# Altium project DE-160516.PrjPcb
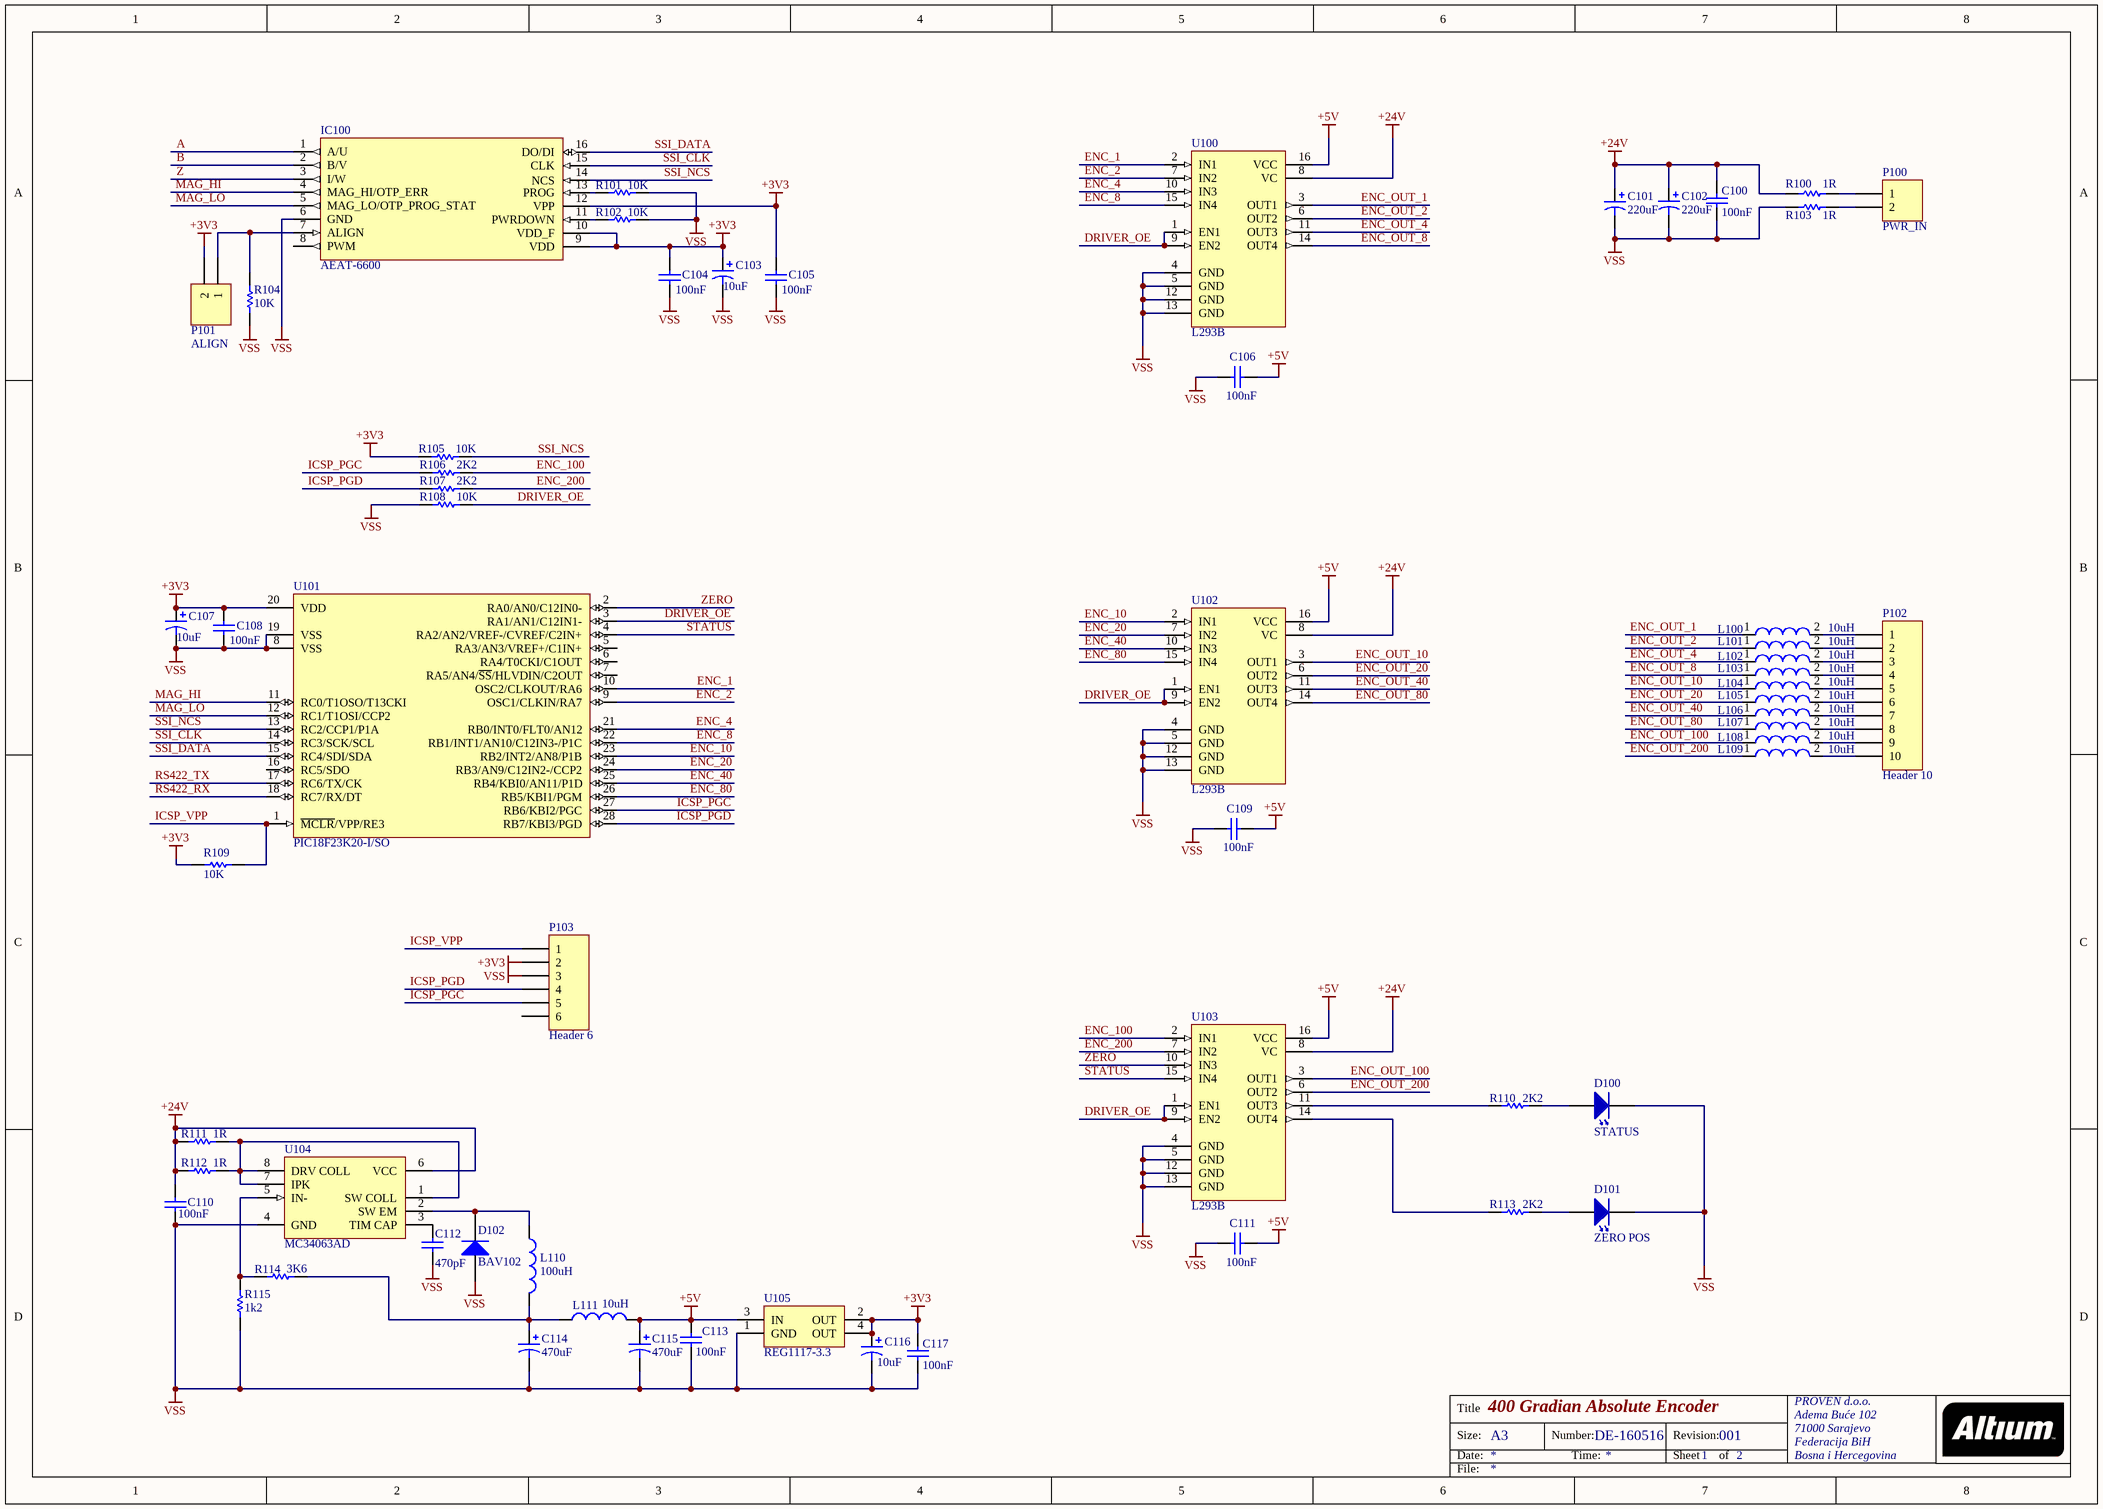
[diagram p0: DE-160516.SchDoc]
1 sheet, 60 parts. Net scope: global (net labels, ports and power ports of the same name join across sheets).
Board file: DE-160516.PcbDoc

## Sheet DE-160516.SchDoc: 400 Gradian Absolute Encoder
size A3; Author: eldar6776@hotmail.com; DrawnBy: Eldar Dedić; Organization: PROVEN d.o.o.; Address1: Adema Buće 102; Address2: 71000 Sarajevo; Address3: Federacija BiH; Address4: Bosna i Hercegovina; DocumentNumber: DE-160516; Revision: 001; SheetNumber: 1; SheetTotal: 2; ProjectName: ABSOLUT_ENCODER

### Parts
C100  value 100nF  [0805]
C101  220uF  [E]
C102  220uF  [E]
C103  10uF  [C]
C104  value 100nF  [0805]
C105  value 100nF  [0805]
C106  value 100nF  [0805]
C107  10uF  [C]
C108  value 100nF  [0805]
C109  value 100nF  [0805]
C110  value 100nF  [1206]
C111  value 100nF  [0805]
C112  value 470pF  [0805]
C113  value 100nF  [0805]
C114  470uF  [CAPPR2.5-6.3X11]
C115  470uF  [CAPPR2.5-6.3X11]
C116  10uF  [49BC-C]
C117  value 100nF  [0805]
D100  STATUS  [LED 3mm]
D101  ZERO POS  [LED 3mm]
D102  BAV102  [SOD80C]
IC100  AEAT-6600  [TSSOP16]
L100  10uH  [SMD-0603]
L101  10uH  [SMD-0603]
L102  10uH  [SMD-0603]
L103  10uH  [SMD-0603]
L104  10uH  [SMD-0603]
L105  10uH  [SMD-0603]
L106  10uH  [SMD-0603]
L107  10uH  [SMD-0603]
L108  10uH  [SMD-0603]
L109  10uH  [SMD-0603]
L110  value 100uH  [RB5-10.5]
L111  value 10uH  [RB5-10.5]
P100  PWR_IN  [HDR1X2]
P101  ALIGN  [HDR1X2]
P102  Header 10  [HDR1X10]
P103  Header 6  [HDR1X6]
R100  1R  [RD6.35x2.3]
R101  10K  [ERA-0603]
R102  10K  [ERA-0603]
R103  1R  [RD6.35x2.3]
R104  10K  [ERA-0603]
R105  10K  [ERA-0603]
R106  2K2  [ERA-0603]
R107  2K2  [ERA-0603]
R108  10K  [ERA-0603]
R109  10K  [ERA-0603]
R110  2K2  [ERA-0603]
R111  1R  [ERA-0805]
R112  1R  [ERA-0805]
R113  2K2  [ERA-0603]
R114  3K6  [ERA-0805]
R115  1k2  [ERA-0805]
U100  L293B  [DIP16]
U101  PIC18F23K20-I/SO  [SOIC-SO28_N]
U102  L293B  [DIP16]
U103  L293B  [DIP16]
U104  MC34063AD  [751-05_N]
U105  REG1117-3.3  [ZZ311]

### Nets
+3V3: C103.1 C104.2 C105.2 C107.1 C108.2 C116.1 C117.2 IC100.9(VDD) IC100.10(VDD_F) IC100.12(VPP) P101.2 P103.2 R105.2 R109.2 U101.20(VDD) U105.2(OUT) U105.4(OUT)
+5V: C106.1 C109.1 C111.1 C113.2 C115.1 L111.2 U100.16(VCC) U102.16(VCC) U103.16(VCC) U105.3(IN)
+24V: C100.2 C101.1 C102.1 C110.2 R100.1 R111.1 R112.1 U100.8(VC) U102.8(VC) U103.8(VC) U104.6(VCC)
VSS: C100.1 C101.2 C102.2 C103.2 C104.1 C105.1 C106.2 C107.2 C108.1 C109.2 C110.1 C111.2 C112.1 C113.1 C114.2 C115.2 C116.2 C117.1 D100.1 D101.1 D102.1(A) IC100.6(GND) P103.3 R101.1 R102.1 R103.1 R104.1 R108.2 R115.1 U100.4(GND) U100.5(GND) U100.12(GND) U100.13(GND) U101.8(VSS) U101.19(VSS) U102.4(GND) U102.5(GND) U102.12(GND) U102.13(GND) U103.4(GND) U103.5(GND) U103.12(GND) U103.13(GND) U104.4(GND) U105.1(GND)
A: IC100.1(A/U)
B: IC100.2(B/V)
DRIVER_OE: R108.1 U100.1(EN1) U100.9(EN2) U101.3(RA1/AN1/C12IN1-) U102.1(EN1) U102.9(EN2) U103.1(EN1) U103.9(EN2)
ENC_1: U100.2(IN1) U101.10(OSC2/CLKOUT/RA6)
ENC_2: U100.7(IN2) U101.9(OSC1/CLKIN/RA7)
ENC_4: U100.10(IN3) U101.21(RB0/INT0/FLT0/AN12)
ENC_8: U100.15(IN4) U101.22(RB1/INT1/AN10/C12IN3-/P1C)
ENC_10: U101.23(RB2/INT2/AN8/P1B) U102.2(IN1)
ENC_20: U101.24(RB3/AN9/C12IN2-/CCP2) U102.7(IN2)
ENC_40: U101.25(RB4/KBI0/AN11/P1D) U102.10(IN3)
ENC_80: U101.26(RB5/KBI1/PGM) U102.15(IN4)
ENC_100: R106.1 U103.2(IN1)
ENC_200: R107.1 U103.7(IN2)
ENC_OUT_1: L100.1 U100.3(OUT1)
ENC_OUT_2: L101.1 U100.6(OUT2)
ENC_OUT_4: L102.1 U100.11(OUT3)
ENC_OUT_8: L103.1 U100.14(OUT4)
ENC_OUT_10: L104.1 U102.3(OUT1)
ENC_OUT_20: L105.1 U102.6(OUT2)
ENC_OUT_40: L106.1 U102.11(OUT3)
ENC_OUT_80: L107.1 U102.14(OUT4)
ENC_OUT_100: L108.1 U103.3(OUT1)
ENC_OUT_200: L109.1 U103.6(OUT2)
ICSP_PGC: P103.5 R106.2 U101.27(RB6/KBI2/PGC)
ICSP_PGD: P103.4 R107.2 U101.28(RB7/KBI3/PGD)
ICSP_VPP: P103.1 R109.1 U101.1(~{MCLR}/VPP/RE3)
MAG_HI: IC100.4(MAG_HI/OTP_ERR) U101.11(RC0/T1OSO/T13CKI)
MAG_LO: IC100.5(MAG_LO/OTP_PROG_STAT) U101.12(RC1/T1OSI/CCP2)
RS422_RX: U101.18(RC7/RX/DT)
RS422_TX: U101.17(RC6/TX/CK)
SSI_CLK: IC100.15(CLK) U101.14(RC3/SCK/SCL)
SSI_DATA: IC100.16(DO/DI) U101.15(RC4/SDI/SDA)
SSI_NCS: IC100.14(NCS) R105.1 U101.13(RC2/CCP1/P1A)
STATUS: U101.4(RA2/AN2/VREF-/CVREF/C2IN+) U103.15(IN4)
Z: IC100.3(I/W)
ZERO: U101.2(RA0/AN0/C12IN0-) U103.10(IN3)
NetC112_2: C112.2 U104.3(TIM_CAP)
NetC114_1: C114.1 L110.2 L111.1 R114.2
NetD100_2: D100.2 R110.2
NetD101_2: D101.2 R113.2
NetD102_2: D102.2(K) L110.1 U104.2(SW_EM)
NetIC100_7: IC100.7(ALIGN) P101.1 R104.2
NetIC100_11: IC100.11(PWRDOWN) R102.2
NetIC100_13: IC100.13(PROG) R101.2
NetL100_2: L100.2 P102.1
NetL101_2: L101.2 P102.2
NetL102_2: L102.2 P102.3
NetL103_2: L103.2 P102.4
NetL104_2: L104.2 P102.5
NetL105_2: L105.2 P102.6
NetL106_2: L106.2 P102.7
NetL107_2: L107.2 P102.8
NetL108_2: L108.2 P102.9
NetL109_2: L109.2 P102.10
NetP100_1: P100.1 R100.2
NetP100_2: P100.2 R103.2
NetR110_1: R110.1 U103.11(OUT3)
NetR111_2: R111.2 R112.2 U104.1(SW_COLL) U104.7(IPK) U104.8(DRV_COLL)
NetR113_1: R113.1 U103.14(OUT4)
NetR114_1: R114.1 R115.2 U104.5(IN-)

Not connected (* = marked no-connect by the designer): IC100 8(PWM); P103 6; U101 5(RA3/AN3/VREF+/C1IN+) 6(RA4/T0CKI/C1OUT) 7(RA5/AN4/~{SS}/HLVDIN/C2OUT) 16(RC5/SDO)

### Notes on the sheet
- Title
- Size:
- Date:
- A3
- Number:
- Time:
- Revision:
- Sheet
- of
- File:

### Library data of the parts
C100 C104-C106 C108 C109 C111-C113 C117 = C0805: Ceramic Chip Capacitor - Standard; Note: Footprint corresponds to dimensions for bulk cassette packaging. This case size has tightened tolerances.; Published: 17-Jul-2002; LatestRevisionDate: 19-Mar-2004; LatestRevisionNote: Silkscreen size reduced.; DatasheetDocument: Mar-2001; PackageDocument: Mar-2001; PackageReference: 0805; Publisher: Altium Limited; Code_JEITA: 0805; Code_IPC: 2012[0805]; ComponentLink1Description: Manufacturer Link; ComponentLink1URL: http://www.kemet.com/; ComponentLink2Description: Datasheet; ComponentLink2URL: http://www.kemet.com/kemet/web/homepage/kechome.nsf/vapubfilesname/F3102TA.pdf/$file/F3102TA.pdf
C101 C102 = 94SS107X0020EBP: Solid Aluminum Capacitor with Organic Semiconductor Electrolyte: 100uF, 20V, Bulk Pack; Note: Part Numbers shown are for ± 20% capacitance tolerance (X0).; PCB_Layout: Complies with Manufacturer's Recommendation.; DrillSize: Nominal, Rounded to the nearest 0.1mm; Published: 19-Mar-2004; DatasheetDocument: 23-May-2001; PackageReference: E; Publisher: Altium Limited; ComponentLink1Description: Manufacturer Link; ComponentLink1URL: http://www.vishay.com/; ComponentLink2Description: Datasheet; ComponentLink2URL: http://www.vishay.com/docs/90008/94ss.pdf; Value: 100uF
C103 C107 = 94SC106X0016CBP: Solid Aluminum Capacitor with Organic Semiconductor Electrolyte: 10uF, 16V, Bulk Pack; Note: Part Numbers shown are for ± 20% capacitance tolerance (X0).; PCB_Layout: Complies with Manufacturer's Recommendation.; DrillSize: Nominal, Rounded to the nearest 0.1mm; Published: 19-Mar-2004; DatasheetDocument: 23-May-2001; PackageReference: C; Publisher: Altium Limited; ComponentLink1Description: Manufacturer Link; ComponentLink1URL: http://www.vishay.com/; ComponentLink2Description: Datasheet; ComponentLink2URL: http://www.vishay.com/docs/90004/94sc.pdf; Value: 10uF
C110 = C1206: Ceramic Chip Capacitor - Standard; Published: 17-Jul-2002; LatestRevisionDate: 19-Mar-2004; LatestRevisionNote: Silkscreen size reduced.; DatasheetDocument: Mar-2001; PackageDocument: Mar-2001; PackageReference: 1206; Publisher: Altium Limited; Code_JEITA: 1206; Code_IPC: 3216 [1206]; ComponentLink1Description: Manufacturer Link; ComponentLink1URL: http://www.kemet.com/; ComponentLink2Description: Datasheet; ComponentLink2URL: http://www.kemet.com/kemet/web/homepage/kechome.nsf/vapubfilesname/F3102TA.pdf/$file/F3102TA.pdf
C114 C115 = EKA00BA347C00: Aluminum Electrolytic Capacitor, Radial Style with Long Leads: 470uF, 10V; Note: Refer to Manufacturer's Data Sheets for other lead formations; DrillSize: Nominal, Rounded To The Nearest 0.1mm; Published: 19-Mar-2004; DatasheetDocument: 20-Feb-2001; PackageReference: CAPPR2.5-6.3X11; Publisher: Altium Limited; ComponentLink1Description: Manufacturer Link; ComponentLink1URL: http://www.vishay.com/; ComponentLink2Description: Datasheet; ComponentLink2URL: http://www.vishay.com/docs/25014/eka.pdf; Value: 470uF
C116 = 49BC685B010M: Conformal Coated Solid Tantalum Chip Capacitor: 6.8uF, 20% Tolerance, 10 WVDC @ -55°C to +85°C, Surge = 13V; Note: See Data Sheet for full range of components; Published: 19-Mar-2004; DatasheetDocument: 05-Jul-2002; PackageReference: 49BC-C; Publisher: Altium Limited; ComponentLink1Description: Manufacturer Link; ComponentLink1URL: http://www.vishay.com/; Value: 6.8uF
D100 D101 = LED 3mm yellow: LED dioda 3 mm
D102 = BAV102: General-purpose Diode; Published: 17-Sep-2003; LatestRevisionDate: 19-Mar-2004; LatestRevisionNote: Silkscreen size reduced.; DatasheetVersion: 17-Sep-1996; PackageVersion: Jan-2002; PackageReference: SOD80C; Publisher: Altium Limited; PackageDescription: Metal Electrode Face (MELF) Diode; Body 3.5 x 1.6 mm (LxDia); ComponentLink1Description: Manufacturer Link; ComponentLink1URL: http://www.semiconductors.philips.com/; ComponentLink2Description: Datasheet; ComponentLink2URL: http://www.semiconductors.philips.com/acrobat/datasheets/BAV100_2.pdf
IC100 = AEAT-6600: Absolute encoder IC
L100-L109 = 7447962: SMD-Multilayer Inductor WE-MI, L = 0.10µH; DatasheetVersion: ver 5, Oct-2004; PackageVersion: 2009; PackageReference: SMD-0603; PackageDescription: Chip Inductor, 2-Leads, Body 1.6 x 0.8 mm; Inductance: 0.10 µH; ComponentLink1Description: Manufacturer URL; ComponentLink1URL: http://www.we-online.com; ComponentLink2Description: Datasheet; ComponentLink2URL: http://www.we-online.de/katalog/media/pdf/7447962.pdf
L110 L111 = PCMC063T-R82MN: SMT Power Choke Coil; Size 7.3×6.6×3.0mm, ±20% Tolerance, 0.82uH, 13A; PCB_Layout: Complies with manufacturer's recommendation.; Published: 26-Sep-2008; DatasheetVersion: Oct-2007; PackageVersion: Oct-2007; PackageReference: PCMC063T; Publisher: Altium Limited; PackageDescription: SM Power Choke Coil; 2 Leads; Body 7.3 x 6.6 x 3.0 mm (LxWxH); ComponentLink1Description: Manufacturer Link; ComponentLink1URL: http://www.susumu.co.jp/; ComponentLink2Description: Datasheet; ComponentLink2URL: http://www.susumu.co.jp/english/pdf/products-j07-01.pdf
P100 P101 = Header 2: Header, 2-Pin; LatestRevisionDate: 17-Jul-2002; LatestRevisionNote: Re-released for DXP Platform.; Publisher: Altium Limited
P102 = Header 10: Header, 10-Pin; LatestRevisionDate: 17-Jul-2002; LatestRevisionNote: Re-released for DXP Platform.; Publisher: Altium Limited
P103 = Header 6: Header, 6-Pin; LatestRevisionDate: 17-Jul-2002; LatestRevisionNote: Re-released for DXP Platform.; Publisher: Altium Limited
R100 R103 = ERD2FC: Flame-Retardant Fuse Type Carbon Film Resistor, 4.7 Ohm to 3.3k Ohm Range, 2% and 5% Tolerance, 0.25 W; Published: 17-Dec-2003; PackageReference: RD6.35x2.3; Publisher: Altium Limited; ComponentLink1Description: Manufacturer Link; ComponentLink1URL: http://www.panasonic.com/industrial/components/resistive_products.htm; ComponentLink2Description: Datasheet; ComponentLink2URL: http://www.panasonic.com/industrial/components/pdf/AOB0000CE5.pdf
R101 R102 R104-R110 R113 = ERAV: Metal Film Thermosensitive Chip Resistor, 0.56 Ohm to 10k Ohm Range, 5% Tolerance, 0603 Size, 0.063 W; Note: If flow soldering, adjust pad width of PCB Footprint to 0.7 - 0.8 times the width of the resistor.; Published: 17-Dec-2003; LatestRevisionDate: 19-Mar-2004; LatestRevisionNote: Silkscreen size reduced.; PackageDocument: Mar-2003; PackageReference: ERA-0603; Publisher: Altium Limited; Code_IPC: 1608 [0603]; ComponentLink1Description: Manufacturer Link; ComponentLink1URL: http://www.panasonic.com/industrial/components/resistive_products.htm; ComponentLink2Description: Datasheet; ComponentLink2URL: http://www.panasonic.com/industrial/components/pdf/AOF0000CE1.pdf
R111 R112 R114 R115 = ERAS: Metal Film Thermosensitive Chip Resistor, 0.56 Ohm to 10k Ohm Range, 5% Tolerance, 0805 Size, 0.1 W; Note: If flow soldering, adjust pad width of PCB Footprint to 0.7 - 0.8 times the width of the resistor.; Published: 17-Dec-2003; LatestRevisionDate: 19-Mar-2004; LatestRevisionNote: Silkscreen size reduced.; PackageDocument: Mar-2003; PackageReference: ERA-0805; Publisher: Altium Limited; Code_IPC: 2012 [0805]; ComponentLink1Description: Manufacturer Link; ComponentLink1URL: http://www.panasonic.com/industrial/components/resistive_products.htm; ComponentLink2Description: Datasheet; ComponentLink2URL: http://www.panasonic.com/industrial/components/pdf/AOF0000CE1.pdf
U100 U102 U103 = L293B: Push-Pull Four Channel Drivers; Published: 8-Jun-2000; LatestRevisionDate: 06-Jun-2005; LatestRevisionNote: Stylized 3D Model Added.; DatasheetVersion: Apr-1993; PackageVersion: Apr-1996; PackageReference: DIP16; Publisher: Altium Limited; PackageDescription: DIP; 16 Leads; Row Spacing 7.62 mm; Pitch 2.54 mm; ComponentLink1Description: Manufacturer Link; ComponentLink1URL: http://www.st.com/; ComponentLink2Description: Datasheet; ComponentLink2URL: http://www.st.com/stonline/products/literature/ds/1328/l293b.pdf
U101 = PIC18F23K20-I/SO: Flash Microcontroller with nanoWatt XLP Technology, 28-pin SOIC, Industrial Temperature; Published: 2-Dec-2009; DatasheetVersion: revF, Sep-2009; PackageVersion: revBB, Aug-2009; PackageReference: SOIC-SO28; Publisher: Altium Limited; PackageDescription: 28-Lead Plastic Small Outline (SO) - Wide 7.50mm Body [SOIC]; Supplier 1: Digi-Key; Supplier Part Number 1: PIC18F23K20-I/SO-ND; Supplier 2: Farnell; Supplier Part Number 2: 1700989; Code_JEDEC: MS-013; ComponentLink1Description: Datasheet; ComponentLink1URL: http://ww1.microchip.com/downloads/en/DeviceDoc/41303F.pdf; ComponentLink2Description: Packaging Specification; ComponentLink2URL: http://www.microchip.com/stellent/groups/techpub_sg/documents/packagingspec/en012702.pdf; ComponentLink3Description: Microchip.com Home; ComponentLink3URL: http://www.microchip.com/
U104 = MC34063AD: DC-to-DC Converter Control Circuit; Published: 15-Apr-2002; LatestRevisionDate: 13-Apr-2006; LatestRevisionNote: IPC-7351 Footprint Added.; DatasheetVersion: 1996; PackageVersion: 1998; PackageReference: 751-05; Publisher: Altium Limited; PackageDescription: 8-Pin Small Outline Integrated Circuit 1.27 mm Pitch; Code_JEDEC: MS-012-AA; Code_IPC: SOIC127P600-8; ComponentLink1Description: Manufacturer Link; ComponentLink1URL: http://www.onsemi.com/site/products/taxonomy/0,4438,503,00.html; ComponentLink2Description: Datasheet; ComponentLink2URL: http://www.onsemi.com/pub/Collateral/MC34063A-D.PDF
U105 = REG1117-3.3: 800mA and 1A Low Dropout Positive Regulator 2.85V, 3.3V, 5V, and Adjustable; Published: 8-Jun-2000; LatestRevisionDate: 17-Jul-2002; LatestRevisionNote: Re-released for DXP Platform.; DatasheetVersion: Sep-1997; PackageVersion: revC; PackageReference: ZZ311; Publisher: Altium Limited; PackageDescription: SOT-223/SC-73; 4 Leads; Body 6.7 x 7.3 mm, inc. leads (LxW max); ComponentLink1Description: Manufacturer Link; ComponentLink1URL: http://www.ti.com/; ComponentLink2Description: Datasheet; ComponentLink2URL: http://www-s.ti.com/sc/ds/REG1117.pdf